# EAGLE design PumpMonitoring (EAGLE 7.6.0)
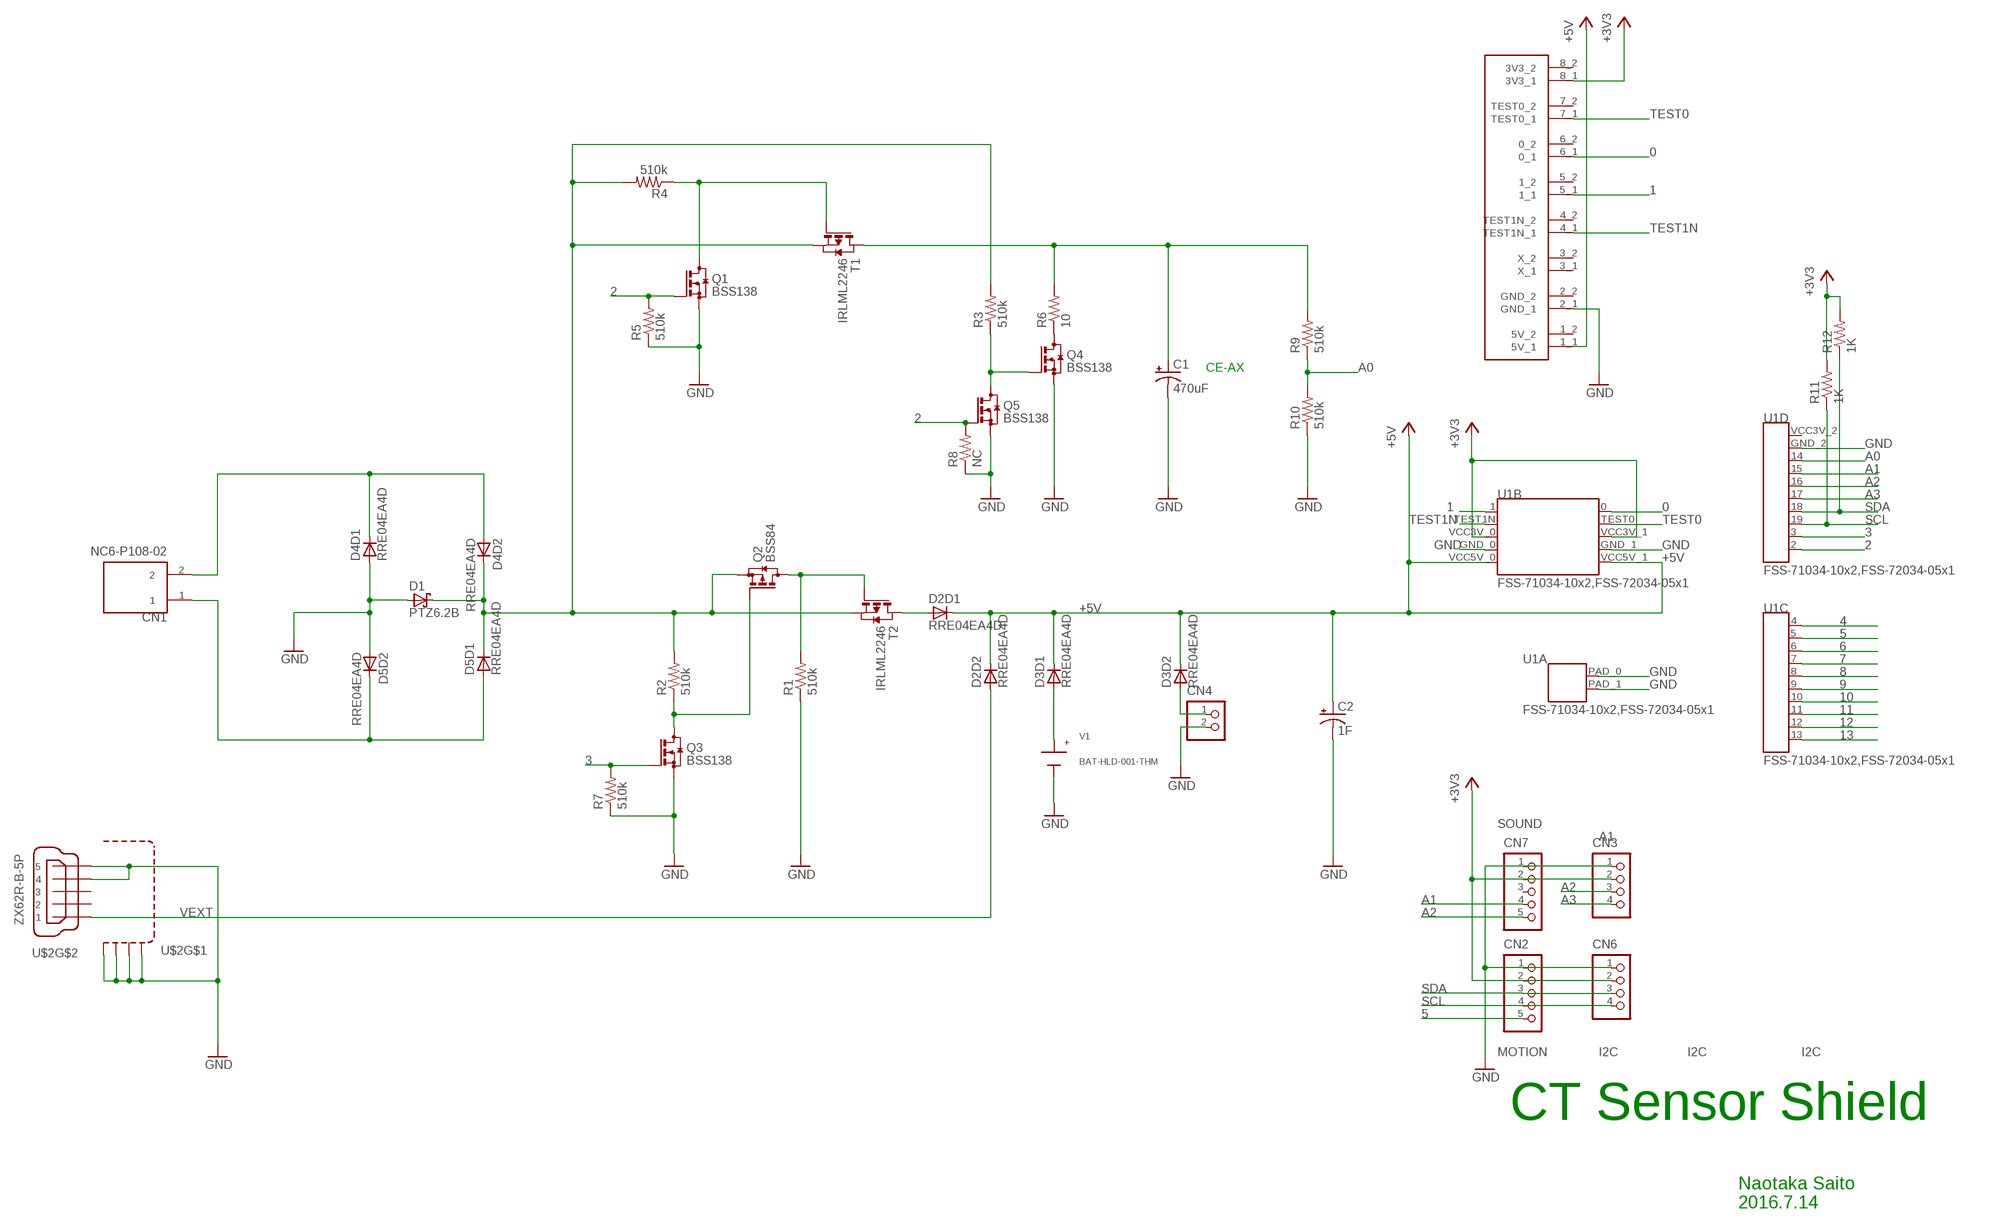
[diagram p0: schematic, sheet 1]

## Parts
C1  470uF  CPOL-USE5-10.5  [E5-10,5]
C2  1F  CPOL-USE5-20  [E5-20]
CN1  NC6-P108-02  TE-NC6-P108-02  [2PIN]
CN2  B5B-PH-K-S  [B5B-PH-K-S]
CN3  B4B-PH-K-S  [B4B-PH-K-S]
CN4  B2B-PH-K-S  [B2B-PH-K-S]
CN6  B4B-PH-K-S  [B4B-PH-K-S]
CN7  B5B-PH-K-S  [B5B-PH-K-S]
D1  PTZ6.2B  PTZXXB  [DO214AC]
D2  RRE04EA4D  [TSMD5]
D3  RRE04EA4D  [TSMD5]
D4  RRE04EA4D  [TSMD5]
D5  RRE04EA4D  [TSMD5]
Q1  BSS138  BSS123  [SOT23]
Q2  BSS84  [SOT23]
Q3  BSS138  BSS123  [SOT23]
Q4  BSS138  BSS123  [SOT23]
Q5  BSS138  BSS123  [SOT23]
R1  510k  R-US_R0603  [R0603]
R2  510k  R-US_R0603  [R0603]
R3  510k  R-US_R0603  [R0603]
R4  510k  R-US_R0603  [R0603]
R5  510k  R-US_R0603  [R0603]
R6  10  MCR18  [EZP]
R7  510k  R-US_R0603  [R0603]
R8  NC  R-US_R0603  [R0603]
R9  510k  R-US_R0603  [R0603]
R10  510k  R-US_R0603  [R0603]
R11  1K  R-US_R0603  [R0603]
R12  1K  R-US_R0603  [R0603]
T1  IRLML2246  PMOSSOT23  [SOT-23]
T2  IRLML2246  PMOSSOT23  [SOT-23]
U1  FSS-71034-10x2,FSS-72034-05x1  LAZURITE920JLAZURITE920J  [LAZURITE920J]
U$1  XB-1-X  [XB-1-X]
U$2  ZX62R-B-5P  MICRO-USB-SHIELD-ZX62R-B-5P  [ZX62R-B-5P]
V1  BAT-HLD-001-THM  [CR2032]

## Nets
0: U1.0 U$1.6_1(0_1)
1: U1.1 U$1.5_1(1_1)
2: Q1.1(G) Q5.1(G) R5.2 R8.2 U1.2
3: Q3.1(G) R7.2 U1.3
4: U1.4
5: CN2.5 U1.5
6: U1.6
7: U1.7
8: U1.8
9: U1.9
10: U1.10
11: U1.11
12: U1.12
13: U1.13
+3V3: CN2.2 CN3.2 CN6.2 CN7.2 R11.2 R12.2 U1.VCC3V_0(B:VCC3V_0) U1.VCC3V_1(B:VCC3V_1) U$1.8_1(3V3_1)
+5V: C2.+ D2.4(D2:C) D2.5(D1:C) D3.4(D2:C) D3.5(D1:C) U1.VCC5V_0(B:VCC5V_0) U1.VCC5V_1(B:VCC5V_1) U$1.1_1(5V_1)
A0: R9.1 R10.2 U1.14
A1: CN7.4 U1.15
A2: CN3.3 CN7.5 U1.16
A3: CN3.4 U1.17
GND: C1.- C2.- CN2.1 CN3.1 CN4.2 CN6.1 CN7.1 D1.A D4.1(D1:A) D5.3(D2:A) Q1.2(S) Q3.2(S) Q4.2(S) Q5.2(S) R1.1 R5.1 R7.1 R8.1 R10.1 U1.GND_0(B:GND_0) U1.GND_1(B:GND_1) U1.GND_2(D:GND_2) U1.PAD_0(A:PAD_0) U1.PAD_1(A:PAD_1) U$1.2_1(GND_1) U$2.4 U$2.5 U$2.M1(S1) U$2.M2(S2) U$2.M3(S3) U$2.M4(S4) V1.GND
I+: CN1.2 D4.3(D2:A) D4.5(D1:C)
I-: CN1.1 D5.1(D1:A) D5.4(D2:C)
IOUT: D1.C D4.4(D2:C) D5.5(D1:C) Q2.2(S) R2.2 R3.2 R4.2 T1.2(S) T2.2(S)
IOUT2: D2.1(D1:A) T2.1(D)
N$1: Q2.3(D) R1.2 T2.3(G)
N$2: D3.1(D1:A) V1.VDD1(VDD) V1.VDD2(VDD) V1.VDD3(VDD) V1.VDD4(VDD)
N$3: CN4.1 D3.3(D2:A)
N$5: Q2.1(G) Q3.3(D) R2.1
N$7: Q1.3(D) R4.1 T1.3(G)
N$9: Q4.3(D) R6.1
N$10: C1.+ R6.2 R9.2 T1.1(D)
N$11: Q4.1(G) Q5.3(D) R3.1
SCL: CN2.4 CN6.4 R11.1 U1.19
SDA: CN2.3 CN6.3 R12.1 U1.18
TEST0: U1.TEST0(B:TEST0) U$1.7_1(TEST0_1)
TEST1N: U1.TEST1N(B:TEST1N) U$1.4_1(TEST1N_1)
VEXT: D2.3(D2:A) U$2.1
Unconnected: CN7.3 U1.VCC3V_2(D:VCC3V_2) U$1.1_2(5V_2) U$1.2_2(GND_2) U$1.3_1(X_1) U$1.3_2(X_2) U$1.4_2(TEST1N_2) U$1.5_2(1_2) U$1.6_2(0_2) U$1.7_2(TEST0_2) U$1.8_2(3V3_2) U$2.2 U$2.3

## Notes on the sheet
- CE-AX
- SOUND
- A1
- MOTION | I2C | I2C | I2C
- CT Sensor Shield
- Naotaka Saito
  2016.7.14

## Library data of the parts
C1 C2 = rcl:CPOL-US: POLARIZED CAPACITOR, American symbol
CN1 = lz-shield:TE-NC6-P108-02: TE-Connectivity-AMP-Connectors NC6-P108-02 http://www.digikey.jp/product-detail/ja/te-connectivity-amp-connectors/NC6-P108-02/A98495-ND/1277926
CN2 CN7 = jst-ph:B5B-PH-*: Wire-to-Board 2.0mm pitch top mount connector Source: http://www.jst-mfg.com/product/pdf/jpn/PH.pdf http://www.jst-mfg.com/product/detail.php?series=199
CN3 CN6 = jst-ph:B4B-PH-*: Wire-to-Board 2.0mm pitch top mount connector Source: http://www.jst-mfg.com/product/pdf/jpn/PH.pdf http://www.jst-mfg.com/product/detail.php?series=199
CN4 = jst-ph:B2B-PH-*: Wire-to-Board 2.0mm pitch top mount connector Source: http://www.jst-mfg.com/product/pdf/jpn/PH.pdf http://www.jst-mfg.com/product/detail.php?series=199
D1 = rohm2:PTZXXB
D2-D5 = rohm2:RRE04EA4D
Q1 Q3-Q5 = transistor-small-signal:BSS123: N-CHANNEL MOS FET
Q2 = transistor-small-signal:BSS84: P-CHANNEL MOS FET
R1-R5 R7-R12 = resistor:R-US_: RESISTOR, American symbol
R6 = rohm2:MCR18
T1 T2 = zetex:PMOSSOT23: MOS FET; OC_FARNELL: unknown; OC_NEWARK: unknown
U1 = lazurite:LAZURITE920J: Lazurite 920J HIROSUGI PSS-710103-10 1.27pitch 1x10pin pin header x 2pcs HIROSUGI PSS-720102-05 1.27pitch 2x5pin pin header
U$1 = lz-shield:XB-1-X
U$2 = con-hirose:MICRO-USB-SHIELD-: Hirose Micro USB Connector ZX62R-B-5P: Micro B, reverse (top mount) shell SMT Supplier: DigiKey H11574CT-ND Source: http://www.hirose.co.jp/cataloge_hp/e24200011.pdf
V1 = mouser:BAT-HLD-001-THM: Mouser 部品番号：712-BAT-HLD-001-THM メーカ部品番号：BAT-HLD-001-THM

## Board
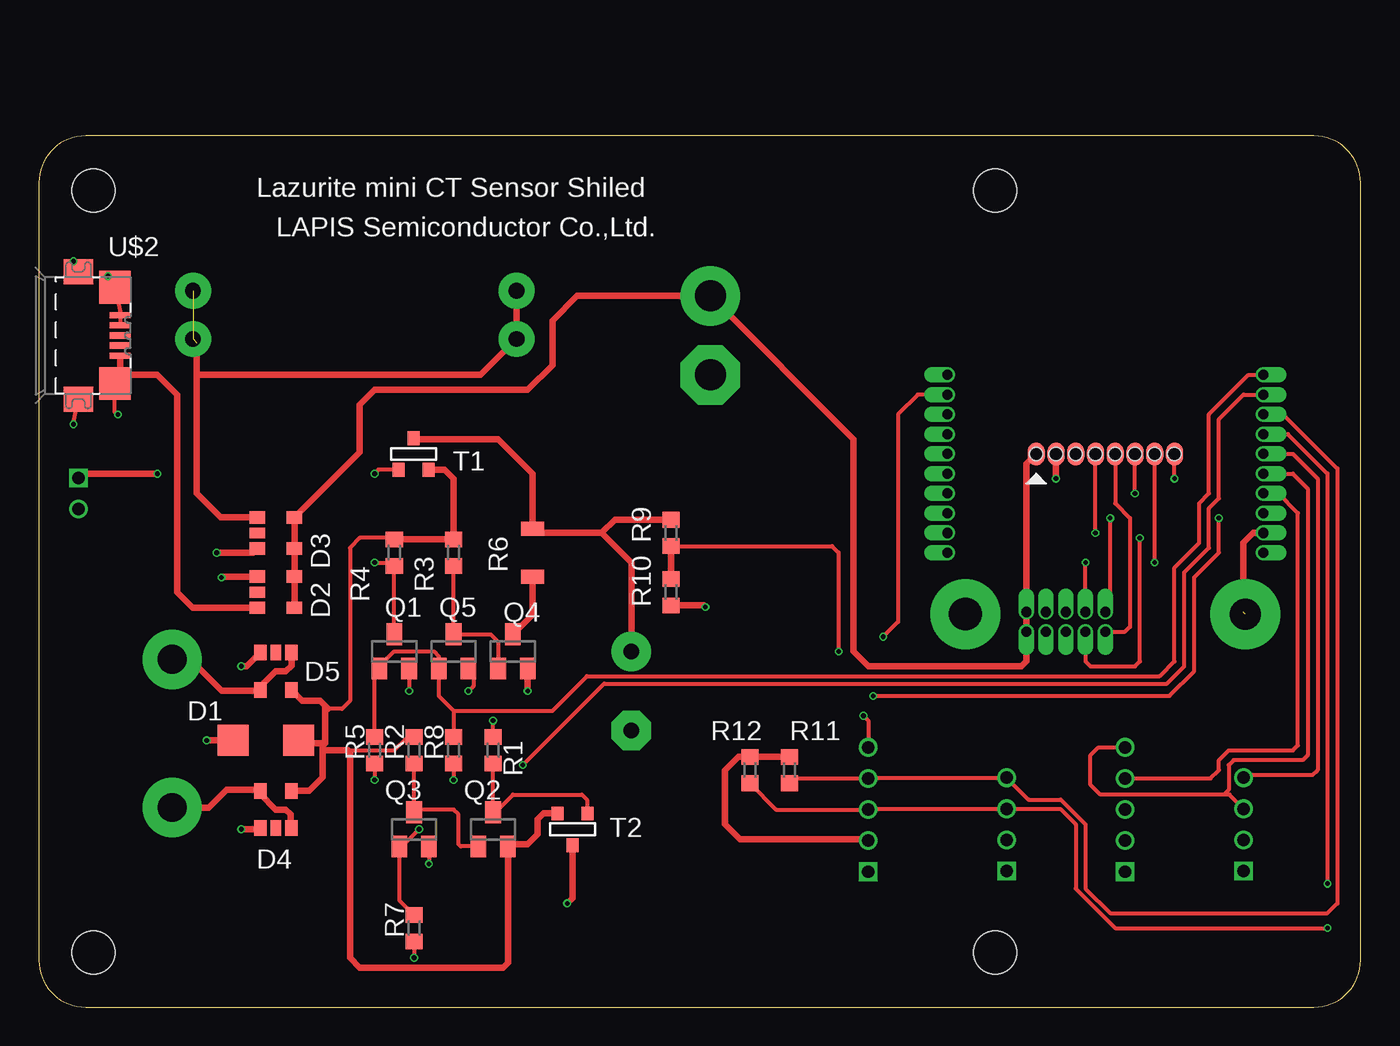
[diagram p1: board, top side]
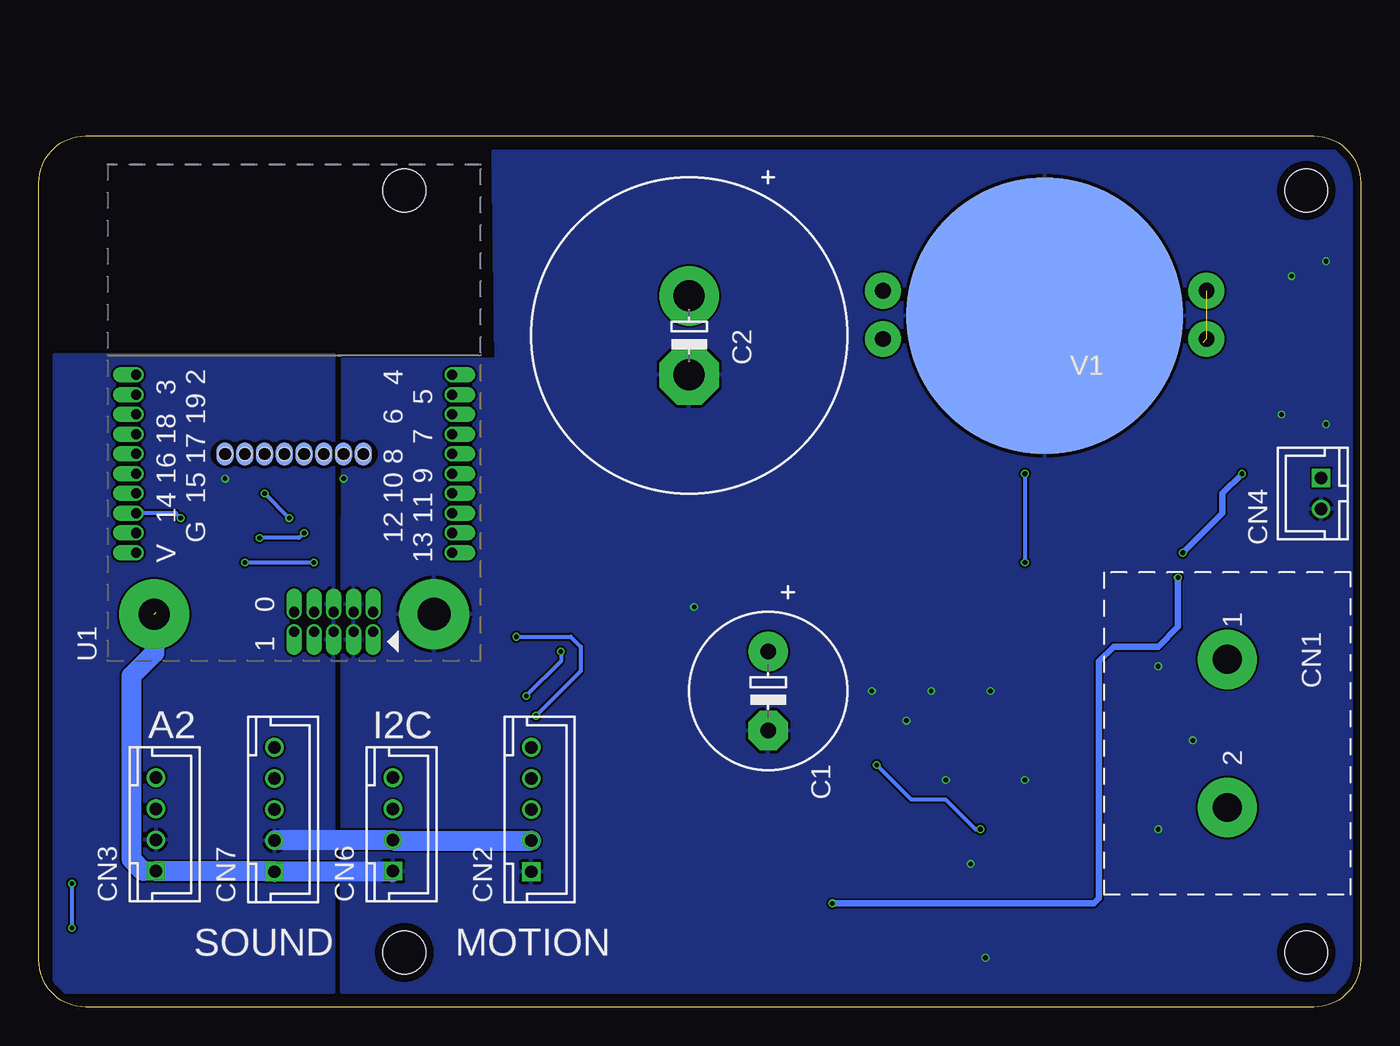
[diagram p2: board, bottom side, seen from below]

Size 85 x 56 mm. Coordinates in mm from the lower left corner, seen from the top.
Outline: 0,3 arc90 3,0 82,0 arc90 85,3 85,53 arc90 82,56 3,56 arc90 0,53 0,3
Copper layers (1*16): Top 0.018mm / dielectric 1.55mm / Bottom 0.018mm
Design rules "unicraft_2layer": minimum track width 0.125mm, minimum drill 0.25mm, track to track 0.125mm, track to pad 0.125mm, pad to pad 0.125mm, via to via 0.125mm, smd to smd 0mil, copper to edge 0.5mm, drill to drill 0.3mm, minimum pad ring 0.175mm, minimum via ring 0.1mm, stop-mask expansion 0mil, vias tented up to drill 0.45mm, thermal gap 0.2mm
Holes 2.75 mm at 3.5,52.5 3.5,3.5 61.5,3.5 61.5,52.5

### Footprints (pad centres in the part's own frame; a part is rotated, then mirrored left to right if it is on the bottom)
E5-10,5 = drill 1.016 pad 2.54: + -2.54,0 | drill 1.016 pad 2.54 octagon: - 2.54,0
E5-20 = drill 2 pad 3.81: + -2.54,0 | drill 2 pad 3.81 octagon: - 2.54,0
2PIN = drill 1.854 pad 3.81: 1 5.588,7.938; 2 15.113,7.938
B5B-PH-K-S = drill 0.8 square: 1 -4,0 | drill 0.8: 2 -2,0; 3 0,0; 4 2,0; 5 4,0
B4B-PH-K-S = drill 0.8 square: 1 -3,0 | drill 0.8: 2 -1,0; 3 1,0; 4 3,0
B2B-PH-K-S = drill 0.8 square: 1 -1,0 | drill 0.8: 2 1,0
DO214AC = smd 2 x 2: A -2.1,0; C 2.1,0
TSMD5 = smd 0.8 x 1: 1 -1,-1.2; 3 1,-1.2; 4 1,1.2; 5 -1,1.2 | smd 0.7 x 1: 2 0,-1.2
SOT23 = smd 1 x 1.4: 1 -0.95,-1.1; 2 0.95,-1.1; 3 0,1.1
R0603 = smd 1 x 1.1: 1 -0.85,0; 2 0.85,0
EZP = smd 0.9 x 1.5: 1 -1.55,0; 2 1.55,0
SOT-23 = smd 0.787 x 0.889: 1 0.025,-1.016; 2 -0.94,1.016; 3 0.991,1.016
LAZURITE920J = drill 0.65 pad 0.8 offset: 0 1.27,5.08; 1 0,5.08; 2 16.51,15.24; 3 15.24,15.24; 4 16.51,-5.08; 5 15.24,-5.08; 6 13.97,-5.08; 7 12.7,-5.08; 8 11.43,-5.08; 9 10.16,-5.08; 10 8.89,-5.08; 11 7.62,-5.08; 12 6.35,-5.08; 13 5.08,-5.08; 14 7.62,15.24; 15 8.89,15.24; 16 10.16,15.24; 17 11.43,15.24; 18 12.7,15.24; 19 13.97,15.24; GND_0 0,1.27; GND_1 1.27,1.27; GND_2 6.35,15.24; TEST0 1.27,3.81; TEST1N 0,3.81; VCC3V_0 0,2.54; VCC3V_1 1.27,2.54; VCC3V_2 5.08,15.24; VCC5V_0 0,0; VCC5V_1 1.27,0 | drill 2.1 pad 4.5: PAD_0 1.135,-3.92 | drill 2 pad 4.5: PAD_1 1.135,14.08
XB-1-X = smd 1.1 x 1.5: 1_1 3.81,0; 2_1 2.54,0; 3_1 1.27,0; 4_1 0,0; 5_1 -1.27,0; 6_1 -2.54,0; 7_1 -3.81,0; 8_1 -5.08,0 | smd 1.1 x 1.5 bottom: 1_2 3.81,0; 2_2 2.54,0; 3_2 1.27,0; 4_2 0,0; 5_2 -1.27,0; 6_2 -2.54,0; 7_2 -3.81,0; 8_2 -5.08,0 | hole 0.85: -5.08,0; -3.81,0; -2.54,0; -1.27,0; 0,0; 1.27,0; 2.54,0; 3.81,0
ZX62R-B-5P = smd 1.35 x 0.4: 1 2.675,-1.3; 2 2.675,-0.65; 3 2.675,0; 4 2.675,0.65; 5 2.675,1.3 | smd 1.9 x 1.6: M1 0,-4.1; M2 0,4.1 | smd 2 x 2.1: M3 2.35,3.1; M4 2.35,-3.1
CR2032 = smd 17.8 x 17.8: GND 0,0 | drill 1 pad 2.3: VDD1 -10.4,1.5; VDD2 -10.4,-1.6; VDD3 10.4,1.5; VDD4 10.4,-1.6

### Placement (x,y rotation side)
C1  38.1,20.32 270 bottom
C2  43.18,43.18 270 bottom
CN1  16.51,27.94 270 bottom
CN2  53.34,12.7 90 bottom
CN3  77.47,11.75 90 bottom
CN4  2.54,33.02 270 bottom
CN6  62.23,11.75 90 bottom
CN7  69.85,12.7 90 bottom
D1  14.61,17.14 0 top
D2  15.24,26.67 270 top
D3  15.24,30.48 270 top
D4  15.24,12.7 0 top
D5  15.24,21.59 180 top
Q1  22.86,22.86 0 top
Q2  29.21,11.43 0 top
Q3  24.13,11.43 0 top
Q4  30.48,22.86 0 top
Q5  26.67,22.86 0 top
R1  29.21,16.51 270 top
R2  24.13,16.51 90 top
R3  26.67,29.21 90 top
R4  22.86,29.21 90 top
R5  21.59,16.51 90 top
R6  31.75,29.21 90 top
R7  24.13,5.08 90 top
R8  26.67,16.51 90 top
R9  40.64,30.48 90 top
R10  40.64,26.67 90 top
R11  48.26,15.24 90 top
R12  45.72,15.24 90 top
T1  24.13,35.56 180 top
T2  34.29,11.43 0 top
U1  63.5,24.13 90 bottom
U$1  67.94,35.56 180 top
U$2  2.54,43.18 0 top
V1  20.32,44.45 180 bottom

### Tracks (layer width: path | path; a pad name or v marks a point on that pad's centre or on a via)
0  (via drill 0.3)
  Top 0.254: U1.0 68.9,25.72 v68.9,31.43 | v70.48,33.02 U$1.6_1
  Bottom 0.254: v68.9,31.43 v70.48,33.02
1
  Top 0.254: U$1.5_1 69.22,32.38 70.17,31.43 70.17,24.45 69.85,24.13 U1.1
2
  Top 0.254: R5.2 21.59,21.44 Q1.1 21.91,21.91 22.86,22.86 25.4,22.86 25.72,22.54 Q5.1 25.72,20 26.67,19.05 | 26.67,19.05 R8.2 | 26.67,19.05 33.02,19.05 35.24,21.27 72.07,21.27 73.03,22.23 73.03,28.26 74.61,29.84 74.61,32.38 75.25,33.02 75.25,38.1 77.79,40.64 U1.2
3  (via drill 0.3)
  Top 0.254: R7.2 23.18,6.88 Q3.1 23.35,10.33 v24.45,11.43 | v31.11,15.56 36.35,20.8 72.55,20.8 73.66,21.91 73.66,27.94 75.25,29.53 75.25,32.07 75.88,32.7 75.88,37.78 77.47,39.37 U1.3
  Bottom 0.254: v24.45,11.43 24.77,11.43 26.67,13.34 28.89,13.34 v31.11,15.56
5  (via drill 0.3)
  Top 0.254: U1.5 56.52,39.37 55.24,38.1 55.24,24.77 v54.29,23.81 | v53.02,18.73 53.34,18.41 CN2.5
  Bottom 0.254: v54.29,23.81 50.8,23.81 50.16,23.18 50.16,21.59 v53.02,18.73
+3V3  (via drill 0.3)
  Top 0.254: v73.03,33.97 U$1.8_1
  Top 0.406: R11.2 R12.2 44.98,16.09 44.13,15.24 44.13,11.75 45.09,10.79 53.24,10.79 CN2.2
  Bottom 0.406: CN7.2 69.8,10.75 | CN6.2 62.18,10.7
  Bottom 1.27: 69.8,10.75 CN6.2 | 62.18,10.7 CN2.2
  pour Bottom: 66.04,41.91 84,41.91 84,1 66.04,1
+5V
  Top 0.406: D2.4 D2.5 D3.4 D3.5 20.64,35.68 20.64,38.73 21.59,39.69 31.43,39.69 33.02,41.27 33.02,44.13 34.61,45.72 C2.+ 52.39,36.51 52.39,22.86 53.34,21.91 63.18,21.91 63.5,22.23 U1.VCC5V_0 U1.VCC5V_1 63.5,34.92 U$1.1_1
A0  (via drill 0.3)
  Top 0.254: R9.1 51.02,29.63 51.44,29.21 v51.44,22.86 | v53.66,20 72.71,20 74.3,21.59 74.3,27.62 75.88,29.21 v75.88,31.43
  Top 0.406: R9.1 R10.2
  Bottom 0.254: v51.44,22.86 51.44,22.23 v53.66,20 | v75.88,31.43 76.2,31.75 U1.14
A1
  Top 0.254: U1.15 79.69,33.02 80.96,31.75 80.96,16.83 80.64,16.51 76.52,16.51 75.88,15.88 75.88,15.24 75.34,14.7 CN7.4
A2
  Top 0.254: 77.52,12.7 CN3.3 76.56,13.65 76.2,13.65 | 70.04,16.51 CN7.5 68.14,16.7 67.63,16.19 67.63,14.29 68.26,13.65 76.2,13.65 | U1.16 80.64,34.29 81.6,33.34 81.6,16.19 81.28,15.88 76.83,15.88 76.52,15.56 76.52,13.97 76.2,13.65
A3
  Top 0.254: U1.17 80.64,35.56 82.23,33.97 82.23,15.24 81.92,14.92 77.64,14.92 CN3.4
GND  (via drill 0.3)  (1 unrouted)
  Top 0.254: R7.1 v24.13,3.17 | Q3.2 v25.08,9.21 | R5.1 v21.59,14.61 | R8.1 v26.67,14.61 | R1.1 v29.21,18.41 | Q5.2 27.94,21.44 27.94,20.64 v27.62,20.32 | Q1.2 v23.81,20.32 | v2.22,37.47 U$2.M1 | v5.08,38.1 4.89,38.23 U$2.M4 | v2.22,47.94 2.54,47.62 U$2.M2 | v4.45,46.99 4.89,46.55 U$2.M3 5.21,44.69 U$2.5 U$2.4
  Top 0.406: v31.43,20.32 Q4.2 | v65.41,33.97 U$1.2_1 | 77.47,25.38 77.47,29.84 78.11,30.48 U1.GND_2 | R10.1 42.76,25.82 v42.86,25.72 | D4.1 14.17,11.43 v13.02,11.43 | D5.3 13.36,21.91 v13.02,21.91 | D1.A v10.79,17.14
  Bottom 0.406: CN6.1 62.28,8.7 | CN7.1 69.9,8.75 | 78.28,8.75 CN3.1
  Bottom 1.27: 62.28,8.7 CN7.1 | 69.9,8.75 CN3.1 | U1.PAD_1 77.58,22.75 79.06,21.27 79.06,9.53 78.28,8.75
  pour Bottom: 0.5,55 55.79,55 55.59,41.62 65.45,41.62 65.53,1 0.5,1
I+
  Top 0.406: CN1.2 10.92,12.83 12.06,13.97 14.17,13.97 D4.5 14.24,13.7 15.24,12.7 15.88,12.7 16.19,12.38 16.19,11.55 D4.3
I-
  Top 0.406: CN1.1 9.72,22.35 11.75,20.32 14.17,20.32 D5.4 14.24,20.59 15.24,21.59 15.88,21.59 16.24,21.95 D5.1
IOUT
  Top 0.254: 20,16.39 20.12,16.51 22.86,16.51 23.71,17.36 R2.2 | R4.2 22.76,30.16 20.64,30.16 20,29.53 20,19.68 19.49,19.17 18.61,19.17
  Top 0.406: T1.2 26.1,34.54 26.67,33.97 R3.2 R4.2 | D5.5 16.95,19.68 18.1,19.68 18.41,19.37 | 18.41,19.37 18.61,19.17 | D4.4 17.39,13.9 18.26,14.76 18.24,14.78 18.24,16.51 | T2.2 32.45,12.45 32.07,12.06 32.07,11.11 31.43,10.48 30.31,10.48 Q2.2 30.16,2.85 29.84,2.54 20.64,2.54 20,3.17 20,16.39 19.88,16.51 18.24,16.51 | 18.24,16.51 18.24,16.96 | 18.24,16.96 16.7,16.96 D1.C | 18.24,16.96 18.41,16.96 18.41,19.37
IOUT2  (via drill 0.3)
  Top 0.406: T2.1 34.31,7.01 v33.97,6.67 | v11.75,27.62 11.79,27.67 D2.1
  Bottom 0.406: v33.97,6.67 17.14,6.67 16.83,6.99 16.83,22.23 15.88,23.18 13.02,23.18 11.75,24.45 v11.75,27.62
N$1
  Top 0.254: R1.2 Q2.3 29.36,12.53 30.48,13.65 34.92,13.65 35.24,13.34 35.24,12.48 T2.3
N$2  (2 unrouted)
  Top 0.406: 10.16,42.71 10.16,40.64 | 10.16,40.64 10.16,33.02 11.7,31.48 D3.1 | 10.16,40.64 28.41,40.64 V1.VDD3 V1.VDD4
N$3  (via drill 0.3)
  Top 0.406: D3.3 13.77,29.21 v11.43,29.21 | CN4.1 2.81,34.29 v7.62,34.29
  Bottom 0.406: v11.43,29.21 8.89,31.75 8.89,33.02 v7.62,34.29
N$5
  Top 0.254: Q2.1 27.14,10.33 26.99,10.48 26.99,12.38 26.67,12.7 24.3,12.7 Q3.3 R2.1
N$7  (via drill 0.3)
  Top 0.254: Q1.3 R4.1 22.64,28.57 v21.59,28.57 | T1.3 21.84,34.54 v21.59,34.29
  Bottom 0.254: v21.59,34.29 v21.59,28.57
N$9
  Top 0.406: R6.1 31.75,25.23 Q4.3
N$10
  Top 0.406: T1.1 24.17,36.51 29.53,36.51 31.75,34.29 R6.2 32.03,30.48 36.2,30.48 | 36.2,30.48 38.1,28.57 C1.+ | R9.2 37.05,31.33 36.2,30.48
N$11
  Top 0.254: Q4.1 29.53,23.5 29.06,23.96 Q5.3 R3.1
SCL
  Top 0.254: R11.1 48.57,14.7 CN2.4 53.39,14.75 CN6.4 63.64,13.34 65.72,13.34 67.31,11.75 67.31,7.62 68.9,6.03 82.87,6.03 83.5,6.67 83.5,34.61 80.01,38.1 U1.19
SDA  (via drill 0.3)
  Top 0.254: R12.1 47.41,12.7 CN2.3 53.39,12.75 CN6.3 65.67,12.75 66.67,11.75 66.67,7.62 69.22,5.08 v82.87,5.08 | U1.18 80.33,36.83 82.87,34.29 v82.87,7.94
  Bottom 0.254: v82.87,5.08 v82.87,7.94
TEST0  (via drill 0.3)
  Top 0.254: U1.TEST0 v67.31,28.57 | v71.75,28.57 U$1.7_1
  Bottom 0.254: v67.31,28.57 v71.75,28.57
TEST1N  (via drill 0.3)
  Top 0.254: v67.94,30.48 U$1.4_1 | U1.TEST1N 67.31,22.23 67.63,21.91 70.48,21.91 70.8,22.23 v70.8,30.16
  Bottom 0.254: v67.94,30.48 68.26,30.16 v70.8,30.16
VEXT
  Top 0.406: U$2.1 5.25,40.64 7.62,40.64 8.89,39.37 8.89,26.67 9.89,25.67 D2.3

### Text on the board
tPlace: Lazurite mini CT Sensor Shiled | LAPIS Semiconductor Co.,Ltd.
bPlace: I2C | A2 | MOTION | SOUND